# Altium schematic sheet IO-Ports_1.SchDoc
size A4; SheetNumber: 5; SheetTotal: 5
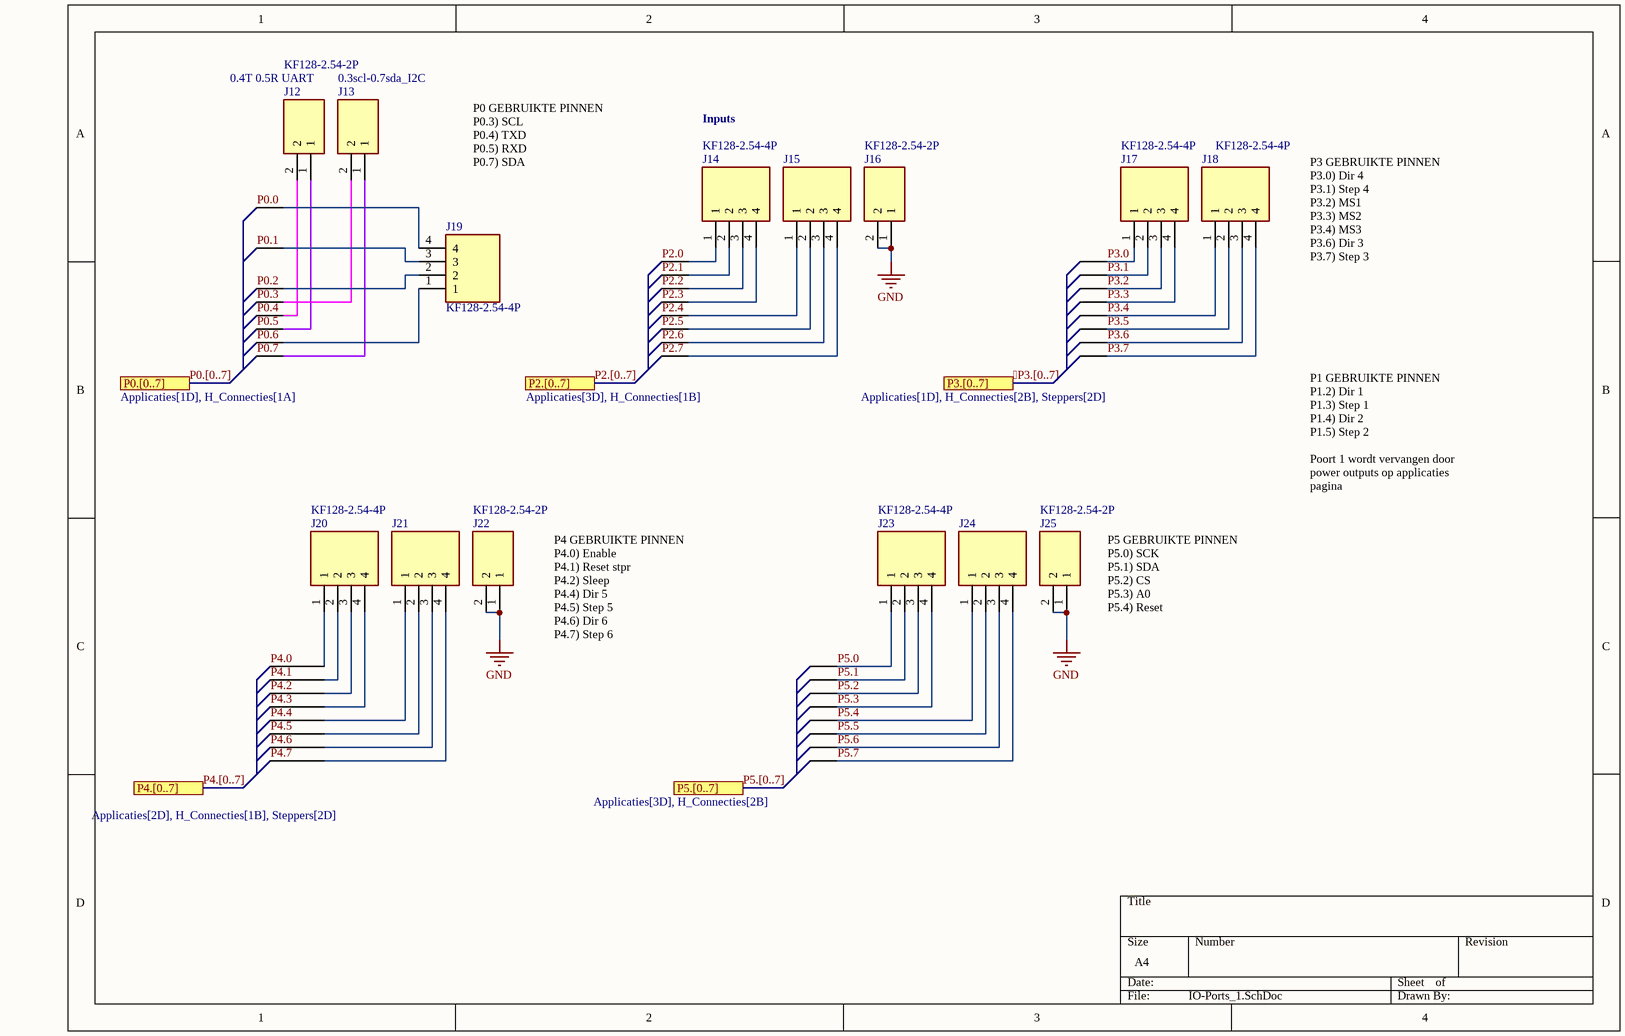
[diagram p0: IO-Ports_1.SchDoc]

## Parts
J12  KF128-2.54-2P  [KF128-2.54-2P]
J13  (no value)  [KF128-2.54-2P]
J14  KF128-2.54-4P  [KF128-2.54-4P]
J15  (no value)  [KF128-2.54-4P]
J16  KF128-2.54-2P  [KF128-2.54-2P]
J17  KF128-2.54-4P  [KF128-2.54-4P]
J18  KF128-2.54-4P  [KF128-2.54-4P]
J19  KF128-2.54-4P  [KF128-2.54-4P]
J20  KF128-2.54-4P  [KF128-2.54-4P]
J21  (no value)  [KF128-2.54-4P]
J22  KF128-2.54-2P  [KF128-2.54-2P]
J23  KF128-2.54-4P  [KF128-2.54-4P]
J24  (no value)  [KF128-2.54-4P]
J25  KF128-2.54-2P  [KF128-2.54-2P]

## Ports
P0.[0..7] (see Applicaties[1D], H_Connecties[1A]), P2.[0..7] (see Applicaties[3D], H_Connecties[1B]), P3.[0..7] (see Applicaties[1D], H_Connecties[2B], Steppers[2D]), P4.[0..7] (see Applicaties[2D], H_Connecties[1B], Steppers[2D]), P5.[0..7] (see Applicaties[3D], H_Connecties[2B])

## Nets
GND: J16.1 J16.2 J22.1 J22.2 J25.1 J25.2
P0.0: J19.4
P0.1: J19.3
P0.2: J19.2
P0.3: J13.2
P0.4: J12.2
P0.5: J12.1
P0.6: J19.1
P0.7: J13.1
P2.0: J14.1
P2.1: J14.2
P2.2: J14.3
P2.3: J14.4
P2.4: J15.1
P2.5: J15.2
P2.6: J15.3
P2.7: J15.4
P3.0: J17.1
P3.1: J17.2
P3.2: J17.3
P3.3: J17.4
P3.4: J18.1
P3.5: J18.2
P3.6: J18.3
P3.7: J18.4
P4.0: J20.1
P4.1: J20.2
P4.2: J20.3
P4.3: J20.4
P4.4: J21.1
P4.5: J21.2
P4.6: J21.3
P4.7: J21.4
P5.0: J23.1
P5.1: J23.2
P5.2: J23.3
P5.3: J23.4
P5.4: J24.1
P5.5: J24.2
P5.6: J24.3
P5.7: J24.4

## Buses and harness runs
bus P3.[0..7] = port P3.[0..7]
bus P0.[0..7] = port P0.[0..7]
bus P2.[0..7] = port P2.[0..7]
bus P4.[0..7] = port P4.[0..7]
bus P5.[0..7] = port P5.[0..7]

## Notes on the sheet
- 0.4T 0.5R UART
- 0.3scl-0.7sda_I2C
- P0 GEBRUIKTE PINNEN
  P0.3) SCL
  P0.4) TXD
  P0.5) RXD
  P0.7) SDA
- Inputs
- P3 GEBRUIKTE PINNEN
  P3.0) Dir 4
  P3.1) Step 4
  P3.2) MS1
  P3.3) MS2
  P3.4) MS3
  P3.6) Dir 3
  P3.7) Step 3
- P1 GEBRUIKTE PINNEN
  P1.2) Dir 1
  P1.3) Step 1
  P1.4) Dir 2
  P1.5) Step 2
  Poort 1 wordt vervangen door power outputs op applicaties pagina
- P4 GEBRUIKTE PINNEN
  P4.0) Enable
  P4.1) Reset stpr
  P4.2) Sleep
  P4.4) Dir 5
  P4.5) Step 5
  P4.6) Dir 6
  P4.7) Step 6
- (near J25) P5 GEBRUIKTE PINNEN
  P5.0) SCK
  P5.1) SDA
  P5.2) CS
  P5.3) A0
  P5.4) Reset

## Library data of the parts
J12 J13 J16 J22 J25 = KF128-2.54-2P: Connector; Manufacturer_Name: CIXI KEFA ELECTRONICS; Datasheet Link: https://jirorwxhqiillo5p.ldycdn.com/KF128-2.54-aidqpBpqKirRliSqmrqirlki.pdf; Height: 9.1mm; Manufacturer_Part_Number: KF128-2.54-2P
  J12: Parameter 1: *
J14 J15 J17-J21 J23 J24 = KF128-2.54-4P: Connector; Manufacturer_Name: CIXI KEFA ELECTRONICS; Datasheet Link: https://jirorwxhqiillo5p.ldycdn.com/KF128-2.54-aidqpBpqKirRliSqmrqirlki.pdf; Height: 9.1mm; Manufacturer_Part_Number: KF128-2.54-4P